# Altium schematic sheet Power.SchDoc
size 203 x 152 mm; SheetNumber: 0; SheetTotal: 0
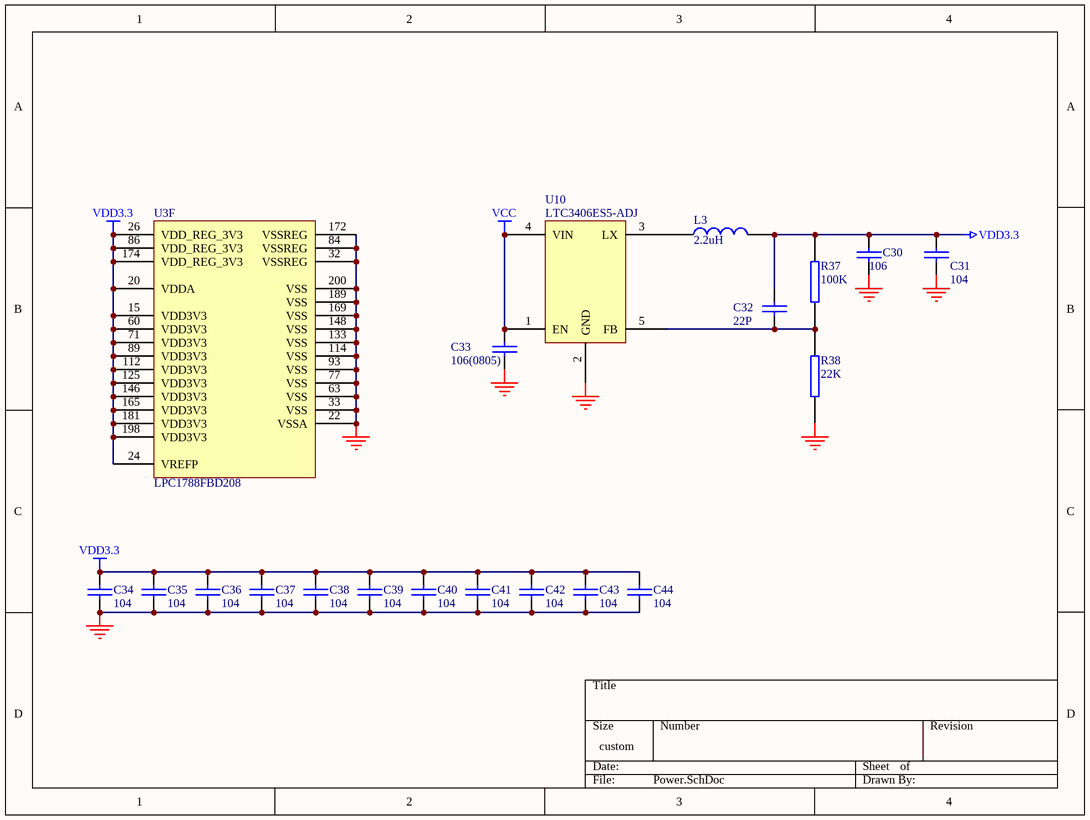
[diagram p0: Power.SchDoc]

## Parts
C30  106  [C0805]
C31  104  [C0603]
C32  22P  [C0603]
C33  106(0805)  [C0805]
C34  104  [C0603]
C35  104  [C0603]
C36  104  [C0603]
C37  104  [C0603]
C38  104  [C0603]
C39  104  [C0603]
C40  104  [C0603]
C41  104  [C0603]
C42  104  [C0603]
C43  104  [C0603]
C44  104  [C0603]
L3  2.2uH  [L4X4]
R37  100K  [R0603]
R38  22K  [R0603]
U3  LPC1788FBD208  [QFP208]  (part F of 8)
U10  LTC3406ES5-ADJ  [SOT23-5]

## Nets
GND: C30.2 C31.2 C33.2 C34.2 C35.2 C36.2 C37.2 C38.2 C39.2 C40.2 C41.2 C42.2 C43.2 C44.2 R38.2 U3.22(VSSA) U3.32(VSSREG) U3.33(VSS) U3.63(VSS) U3.77(VSS) U3.84(VSSREG) U3.93(VSS) U3.114(VSS) U3.133(VSS) U3.148(VSS) U3.169(VSS) U3.172(VSSREG) U3.189(VSS) U3.200(VSS) U10.2(GND)
VCC: C33.1 U10.1(EN) U10.4(VIN)
VDD3.3: C30.1 C31.1 C32.1 C34.1 C35.1 C36.1 C37.1 C38.1 C39.1 C40.1 C41.1 C42.1 C43.1 C44.1 L3.2 R37.2 U3.15(VDD3V3) U3.20(VDDA) U3.24(VREFP) U3.26(VDD_REG_3V3) U3.60(VDD3V3) U3.71(VDD3V3) U3.86(VDD_REG_3V3) U3.89(VDD3V3) U3.112(VDD3V3) U3.125(VDD3V3) U3.146(VDD3V3) U3.165(VDD3V3) U3.174(VDD_REG_3V3) U3.181(VDD3V3) U3.198(VDD3V3)
NetC32_2: C32.2 R37.1 R38.1 U10.5(FB)
NetL3_1: L3.1 U10.3(LX)

## Library data of the parts
C30-C44 = CAP: Capacitor
L3 = INDUCTOR
R37 R38 = RES2
U10 = LTC3406ES5/RT8008